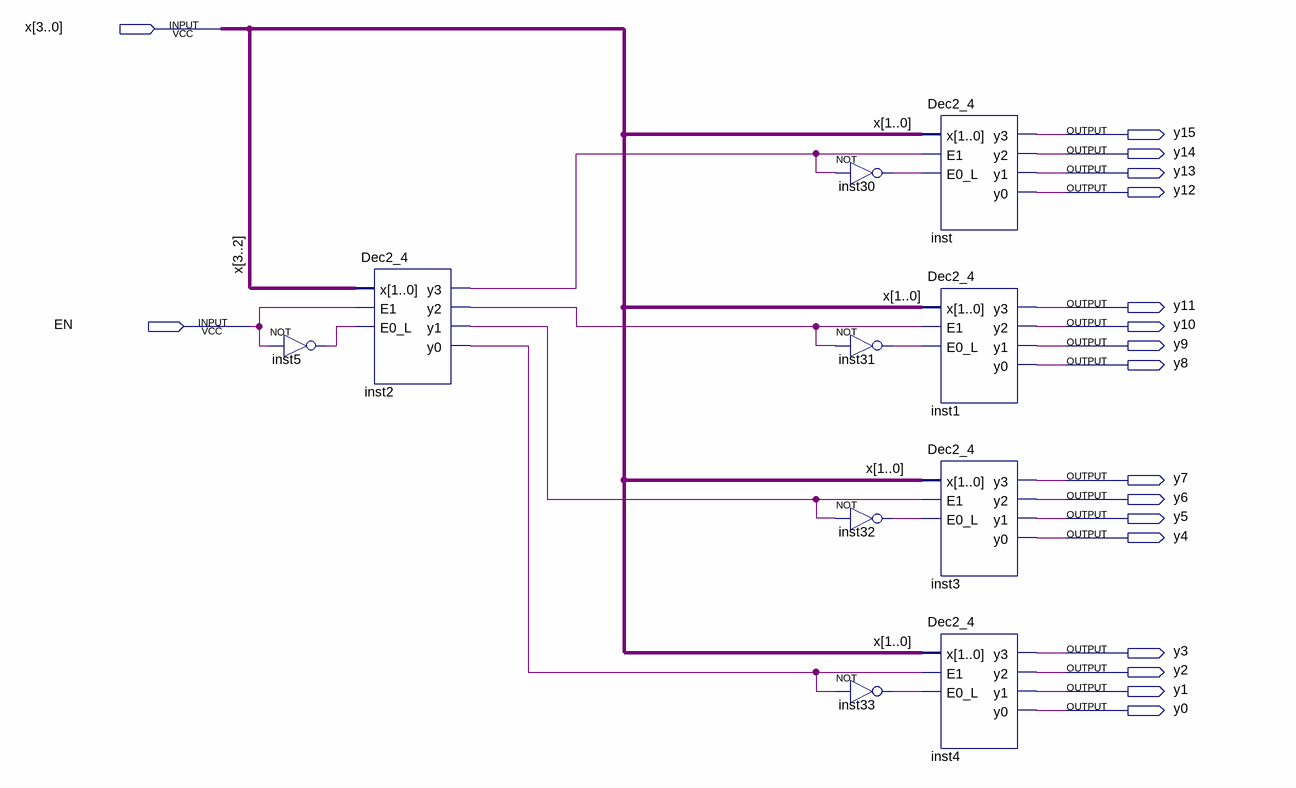
[diagram p0: schematic sheet]
// Quartus schematic Dec4_16.bdf as structural Verilog: 10 symbols, 18 pins
module Dec4_16 (
  input  [3:0] x,
  input  EN,
  output y15,
  output y14,
  output y13,
  output y12,
  output y11,
  output y10,
  output y9,
  output y8,
  output y7,
  output y6,
  output y5,
  output y4,
  output y3,
  output y2,
  output y1,
  output y0
);

  wire inst2_y0, inst2_y1, inst2_y2, inst2_y3, inst5_out, inst30_out, inst31_out, inst32_out, inst33_out;

  not inst5 (inst5_out, EN);
  Dec2_4 inst2 (.x(x[3:2]), .E1(EN), .E0_L(inst5_out), .y3(inst2_y3), .y2(inst2_y2), .y1(inst2_y1), .y0(inst2_y0));
  not inst30 (inst30_out, inst2_y3);
  not inst31 (inst31_out, inst2_y2);
  not inst32 (inst32_out, inst2_y1);
  not inst33 (inst33_out, inst2_y0);
  Dec2_4 inst (.x(x[1:0]), .E1(inst2_y3), .E0_L(inst30_out), .y3(y15), .y2(y14), .y1(y13), .y0(y12));
  Dec2_4 inst1 (.x(x[1:0]), .E1(inst2_y2), .E0_L(inst31_out), .y3(y11), .y2(y10), .y1(y9), .y0(y8));
  Dec2_4 inst3 (.x(x[1:0]), .E1(inst2_y1), .E0_L(inst32_out), .y3(y7), .y2(y6), .y1(y5), .y0(y4));
  Dec2_4 inst4 (.x(x[1:0]), .E1(inst2_y0), .E0_L(inst33_out), .y3(y3), .y2(y2), .y1(y1), .y0(y0));
endmodule
